# Altium schematic sheet 2126_A_MatrixBoard_AffichageMatricielNomEtudiant.SchDoc
size A3; Author: Ricardo Crespo; Organization: ETML-ES; Address1: Avenue Recordon 1; Address2: 1004 Lausanne; Address3: Switzerland; Revision: A; SheetNumber: 1; SheetTotal: 1
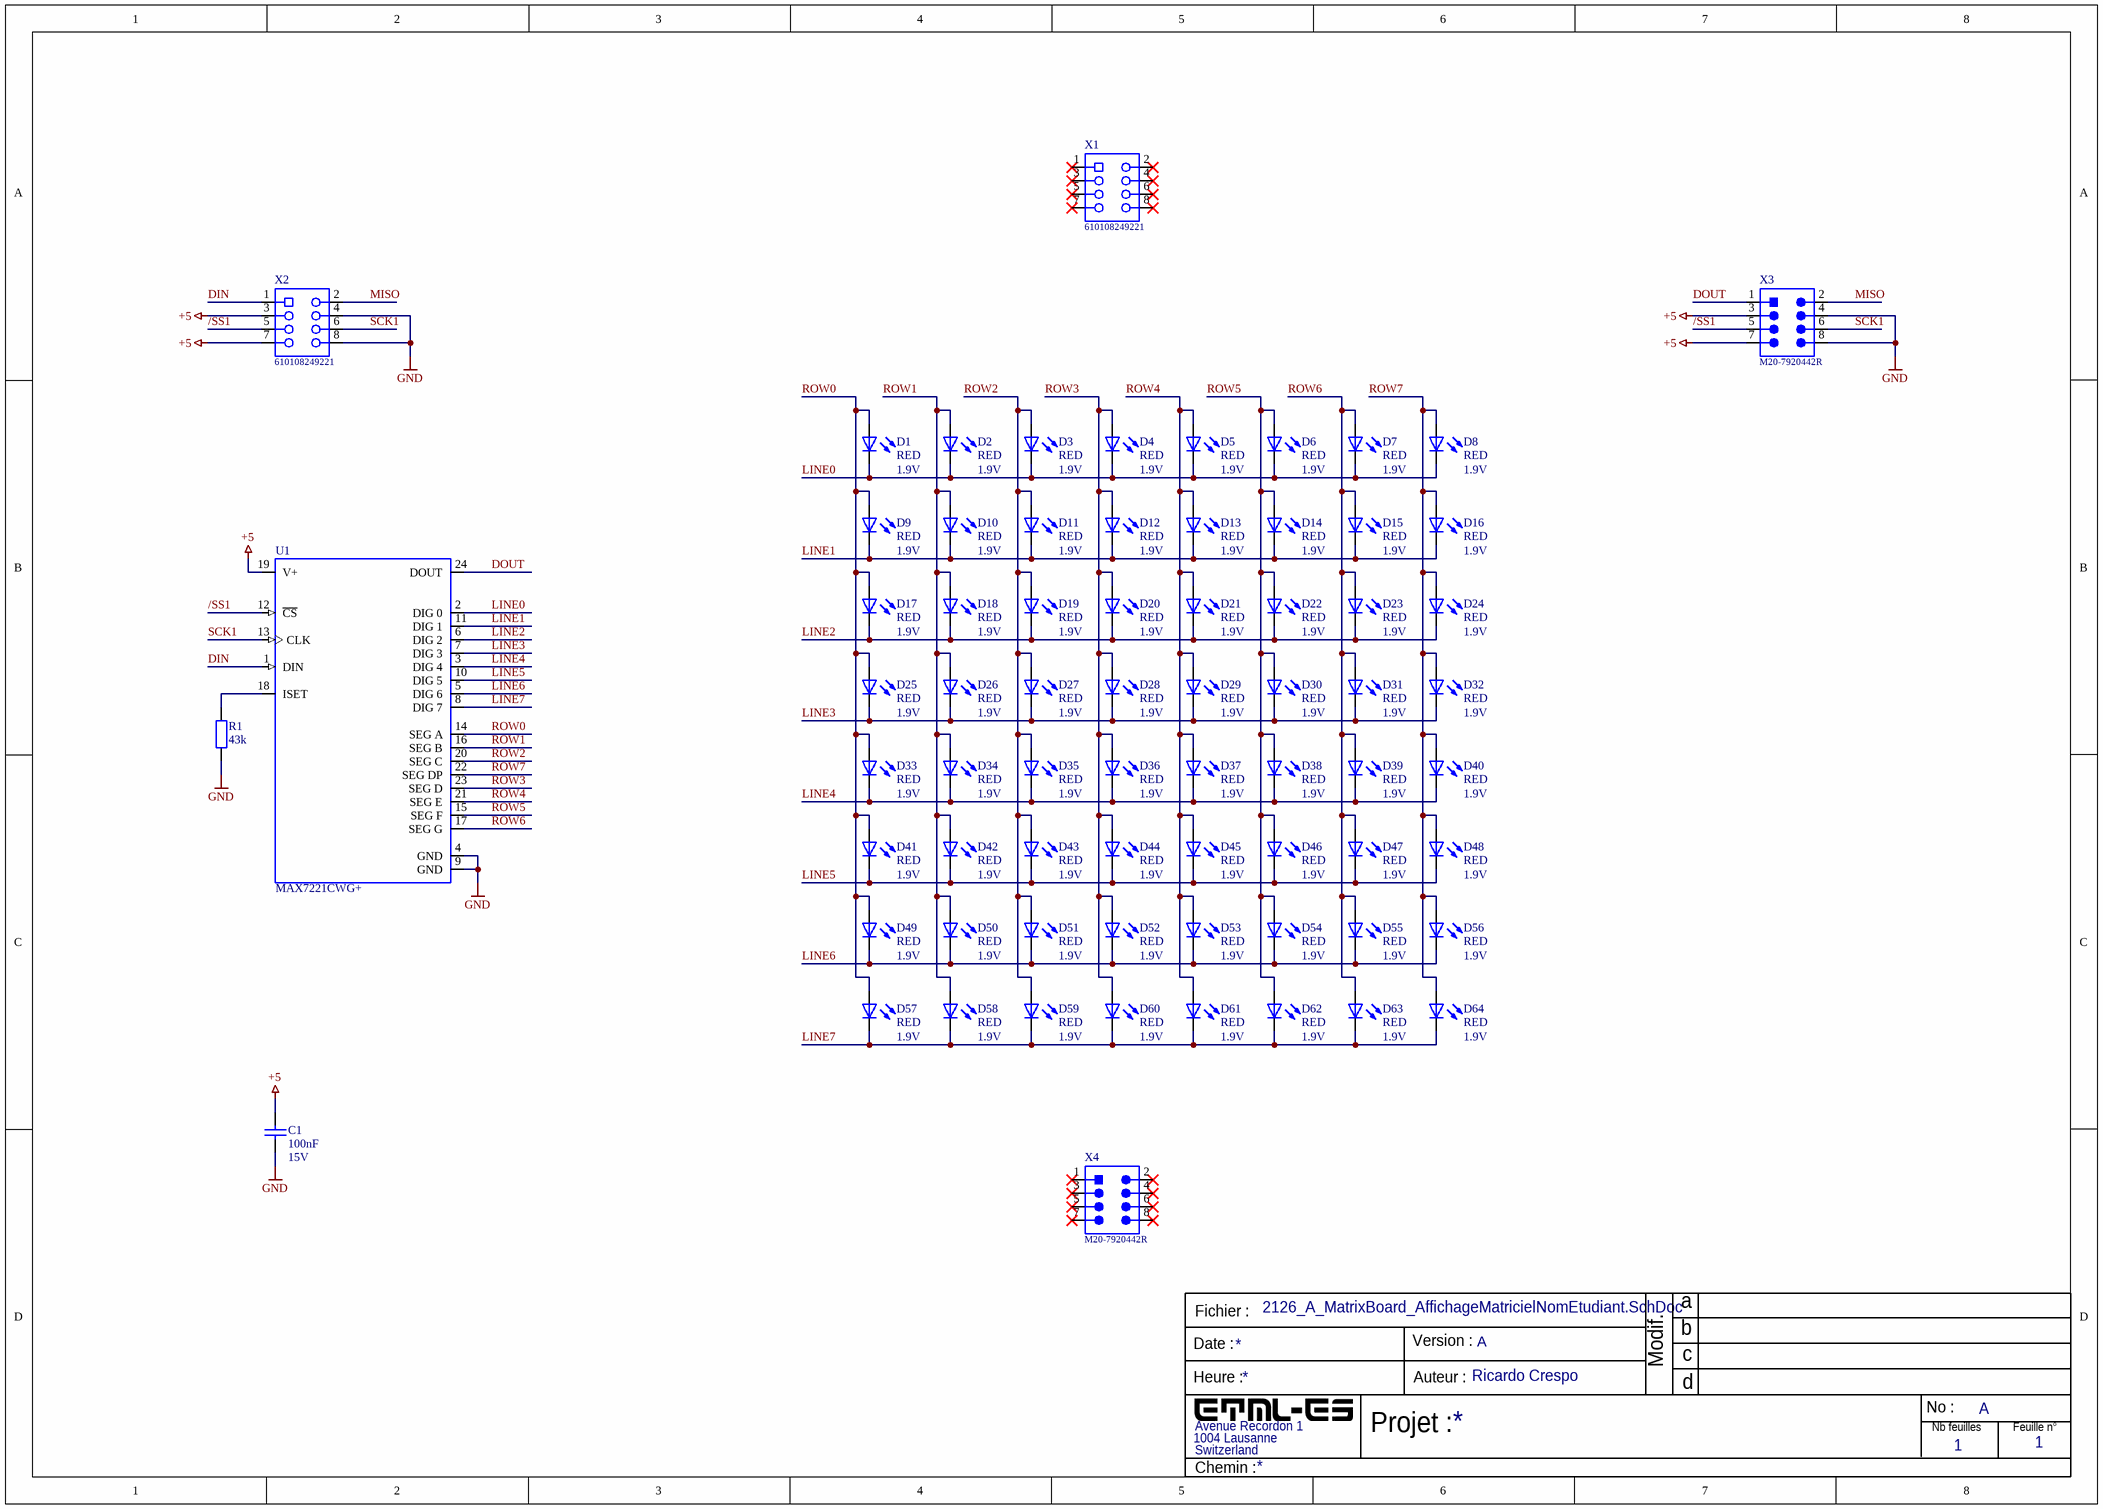
[diagram p0: 2126_A_MatrixBoard_AffichageMatricielNomEtudiant.SchDoc]

## Parts
C1  100nF  [CAPC2013X145X48NL20T23]
D1  RED  [SODFL350X210-2N]
D2  RED  [SODFL350X210-2N]
D3  RED  [SODFL350X210-2N]
D4  RED  [SODFL350X210-2N]
D5  RED  [SODFL350X210-2N]
D6  RED  [SODFL350X210-2N]
D7  RED  [SODFL350X210-2N]
D8  RED  [SODFL350X210-2N]
D9  RED  [SODFL350X210-2N]
D10  RED  [SODFL350X210-2N]
D11  RED  [SODFL350X210-2N]
D12  RED  [SODFL350X210-2N]
D13  RED  [SODFL350X210-2N]
D14  RED  [SODFL350X210-2N]
D15  RED  [SODFL350X210-2N]
D16  RED  [SODFL350X210-2N]
D17  RED  [SODFL350X210-2N]
D18  RED  [SODFL350X210-2N]
D19  RED  [SODFL350X210-2N]
D20  RED  [SODFL350X210-2N]
D21  RED  [SODFL350X210-2N]
D22  RED  [SODFL350X210-2N]
D23  RED  [SODFL350X210-2N]
D24  RED  [SODFL350X210-2N]
D25  RED  [SODFL350X210-2N]
D26  RED  [SODFL350X210-2N]
D27  RED  [SODFL350X210-2N]
D28  RED  [SODFL350X210-2N]
D29  RED  [SODFL350X210-2N]
D30  RED  [SODFL350X210-2N]
D31  RED  [SODFL350X210-2N]
D32  RED  [SODFL350X210-2N]
D33  RED  [SODFL350X210-2N]
D34  RED  [SODFL350X210-2N]
D35  RED  [SODFL350X210-2N]
D36  RED  [SODFL350X210-2N]
D37  RED  [SODFL350X210-2N]
D38  RED  [SODFL350X210-2N]
D39  RED  [SODFL350X210-2N]
D40  RED  [SODFL350X210-2N]
D41  RED  [SODFL350X210-2N]
D42  RED  [SODFL350X210-2N]
D43  RED  [SODFL350X210-2N]
D44  RED  [SODFL350X210-2N]
D45  RED  [SODFL350X210-2N]
D46  RED  [SODFL350X210-2N]
D47  RED  [SODFL350X210-2N]
D48  RED  [SODFL350X210-2N]
D49  RED  [SODFL350X210-2N]
D50  RED  [SODFL350X210-2N]
D51  RED  [SODFL350X210-2N]
D52  RED  [SODFL350X210-2N]
D53  RED  [SODFL350X210-2N]
D54  RED  [SODFL350X210-2N]
D55  RED  [SODFL350X210-2N]
D56  RED  [SODFL350X210-2N]
D57  RED  [SODFL350X210-2N]
D58  RED  [SODFL350X210-2N]
D59  RED  [SODFL350X210-2N]
D60  RED  [SODFL350X210-2N]
D61  RED  [SODFL350X210-2N]
D62  RED  [SODFL350X210-2N]
D63  RED  [SODFL350X210-2N]
D64  RED  [SODFL350X210-2N]
R1  43k  [RESC2013X70X40ML20T20]
U1  MAX7221CWG+  [FP-W24-1-IPC_B]
X1  610108249221  [610108249221]
X2  610108249221  [610108249221]
X3  M20-7920442R  [610108249121]
X4  M20-7920442R  [610108249121]

## Nets
+5: C1.2 U1.19(V+) X2.3 X2.7 X3.3 X3.7
GND: C1.1 R1.1 U1.4(GND) U1.9(GND) X2.4 X2.8 X3.4 X3.8
/SS1: U1.12(~{CS}) X2.5 X3.5
DIN: U1.1(DIN) X2.1
DOUT: U1.24(DOUT) X3.1
LINE0: D1.K D2.K D3.K D4.K D5.K D6.K D7.K D8.K U1.2(DIG_0)
LINE1: D9.K D10.K D11.K D12.K D13.K D14.K D15.K D16.K U1.11(DIG_1)
LINE2: D17.K D18.K D19.K D20.K D21.K D22.K D23.K D24.K U1.6(DIG_2)
LINE3: D25.K D26.K D27.K D28.K D29.K D30.K D31.K D32.K U1.7(DIG_3)
LINE4: D33.K D34.K D35.K D36.K D37.K D38.K D39.K D40.K U1.3(DIG_4)
LINE5: D41.K D42.K D43.K D44.K D45.K D46.K D47.K D48.K U1.10(DIG_5)
LINE6: D49.K D50.K D51.K D52.K D53.K D54.K D55.K D56.K U1.5(DIG_6)
LINE7: D57.K D58.K D59.K D60.K D61.K D62.K D63.K D64.K U1.8(DIG_7)
MISO: X2.2 X3.2
ROW0: D1.A D9.A D17.A D25.A D33.A D41.A D49.A D57.A U1.14(SEG_A)
ROW1: D2.A D10.A D18.A D26.A D34.A D42.A D50.A D58.A U1.16(SEG_B)
ROW2: D3.A D11.A D19.A D27.A D35.A D43.A D51.A D59.A U1.20(SEG_C)
ROW3: D4.A D12.A D20.A D28.A D36.A D44.A D52.A D60.A U1.23(SEG_D)
ROW4: D5.A D13.A D21.A D29.A D37.A D45.A D53.A D61.A U1.21(SEG_E)
ROW5: D6.A D14.A D22.A D30.A D38.A D46.A D54.A D62.A U1.15(SEG_F)
ROW6: D7.A D15.A D23.A D31.A D39.A D47.A D55.A D63.A U1.17(SEG_G)
ROW7: D8.A D16.A D24.A D32.A D40.A D48.A D56.A D64.A U1.22(SEG_DP)
SCK1: U1.13(CLK) X2.6 X3.6
NetR1_2: R1.2 U1.18(ISET)

Not connected (* = marked no-connect by the designer): X1 1* 2* 3* 4* 5* 6* 7* 8*; X4 1* 2* 3* 4* 5* 6* 7* 8*

## Notes on the sheet
- 1.9V
- (near D64) 1.9V
- (near C1) 15V
- A
- Fichier :
- a
- Date :
- Heure :
- Version :
- Auteur :
- Modif.
- b
- c
- d
- Projet :
- No :
- Nb feuilles
- Feuille n°
- Chemin :

## Library data of the parts
C1 = CMP-2007-03167-1: VJ0805Y104KNAAT; Manufacturer: Vitramon; Manufacturer 1: Vishay Vitramon; Part Number: VJ0805Y104KNAAT; Manufacturer Part Number 1: VJ0805Y104KNAAT
D1-D64 = 151031VS04000: WL-TMRC THT Mono-color Round Color, size 3mm, Bright Green, 2.1V, 40deg; Luminous Intensity: 120mcd; Dominant Wavelength: 570nm; Peak Wavelength: 573nm; Chip Technology: AlInGaP; ComponentLink1Description: Manufacturer; ComponentLink1URL: http://www.we-online.de; ComponentLink2Description: Datasheet; ComponentLink2URL: https://katalog.we-online.de/led/datasheet/151031VS04000.pdf; Emitting Color: Bright Green; Operating Temperature: -40 to +85degC; Mounting Technology: THT; Forward Voltage: 2.1V; Part Number: 151031VS04000; Packaging: Bulk; Published Date: January 2021; Publisher: Wurth Elektronik; Size: 3mm; Viewing Angle: 40deg
R1 = CMP-1013-00623-1: 10K 0.125W 1% 0805 (2012 Metric)  SMD; Manufacturer 1: Vishay Dale; Manufacturer Part Number 1: CRCW080510K0FKEC; Manufacturer 10: Panasonic; Manufacturer Part Number 10: ERJ-6ENF1002V; Case-Metric: 2012; Case-EIA: 0805; Tolerance: 1 %; Technology: SMT; Supplier 1: Digi-Key; Supplier Part Number 1: 541-10.0KCCT-ND; Manufacturer 2: Yageo; Manufacturer Part Number 2: RC0805FR-0710KL; Manufacturer 3: Vishay Dale; Manufacturer Part Number 3: CRCW080510K0FKTC; Manufacturer 4: Vishay Dale; Manufacturer Part Number 4: CRCW080510K0FKEB; Manufacturer 5: Bourns; Manufacturer Part Number 5: CR0805-FX-1002ELF; Manufacturer 6: Rohm; Manufacturer Part Number 6: MCR10EZPF1002; Manufacturer 7: Vishay; Manufacturer Part Number 7: CRCW080510K0FKEA; Manufacturer 8: Vishay Dale; Manufacturer Part Number 8: CRCW080510K0FKTB; Manufacturer 9: Vishay Dale; Manufacturer Part Number 9: CRCW080510K0FKTA; Value: 10k; Power: 0.125 W
U1 = CMP-05718-000002-1: IC DRVR 7 SEGMNT 8 DIGIT 24SOIC; Manufacturer: Maxim Integrated; Nominal Supply Current: 330mA; Max Power Dissipation: 941mW; Standoff Height: 0.1mm; Min Supply Voltage: 4V; Max Supply Voltage: 5.5V; Max Junction Temp: +150°C; Number Of Outputs: 8; Lead Free: Yes; Device Class L2: Power Management ICs; Height: 2.65mm; Temperature: 0°C to +70°C; Category: IC; Ipc Land Pattern Name: SOIC127P1032X250-24; Temperature Range High: +70°C; Package: W24-1; Manufacturer Part Number: MAX7221CWG+; Device Class L3: LED Drivers; ComponentLink2URL: https://datasheets.maximintegrated.com/en/ds/MAX7219-MAX7221.pdf; Temperature Range Low: 0°C; Device Class L1: Integrated Circuits (ICs); ComponentLink2Description: Datasheet; Digikey Description: IC DRVR 7 SEGMNT 8 DIGIT 24SOIC; Mouser Description: In a Tube of 30, Maxim MAX7221CWG+, LED Driver, 8-Digits 64-Segments, 5 V, 24-Pin SOIC W; RoHS: TRUE; Octopart: https://octopart.com/max7221cwg%2B-maxim+integrated-39581478; Automotive: No; Footprint Url: https://pdfserv.maximintegrated.com/land_patterns/90-0182.PDF
X1 X2 = 610108249221: WR-PHD Socket Header, THT, pitch 2.54mm, Dual Row, Angled, 8p; Manufacturer Part Number: 613008243121; Manufacturer: Wurth Elektronik; Pin Number: 8; Rated Current: 3A; Working Voltage: 250VAC; Withstanding Voltage: 500VAC; Contact Resistance: 20mOhm; ComponentLink1Description: Manufacturer; ComponentLink1URL: http://www.we-online.de; ComponentLink2Description: Datasheet; ComponentLink2URL: https://www.we-online.com/catalog/datasheet/613008243121.pdf; Pitch: 2.54mm; Operating Temperature: -40 to +125degC; Mounting Technology: THT; Packaging: Tray; Gender: Socket Header; Row Number: Dual; Orientation: Angled
X3 X4 = 610108249121: WR-PHD Pin Header, THT, pitch 2.54mm, Dual Row, Angled, 8p; Manufacturer Part Number: 61300821021; Manufacturer: Wurth Elektronik; Pin Number: 8; Rated Current: 3A; Working Voltage: 250VAC; Withstanding Voltage: 500VAC; Contact Resistance: 20mOhm; ComponentLink1Description: Manufacturer; ComponentLink1URL: http://www.we-online.de; ComponentLink2Description: Datasheet; ComponentLink2URL: https://www.we-online.com/catalog/datasheet/61300821021.pdf; Pitch: 2.54mm; Operating Temperature: -40 to +105degC; Mounting Technology: THT; Packaging: Bag; Gender: Pin Header; Row Number: Dual; Orientation: Angled